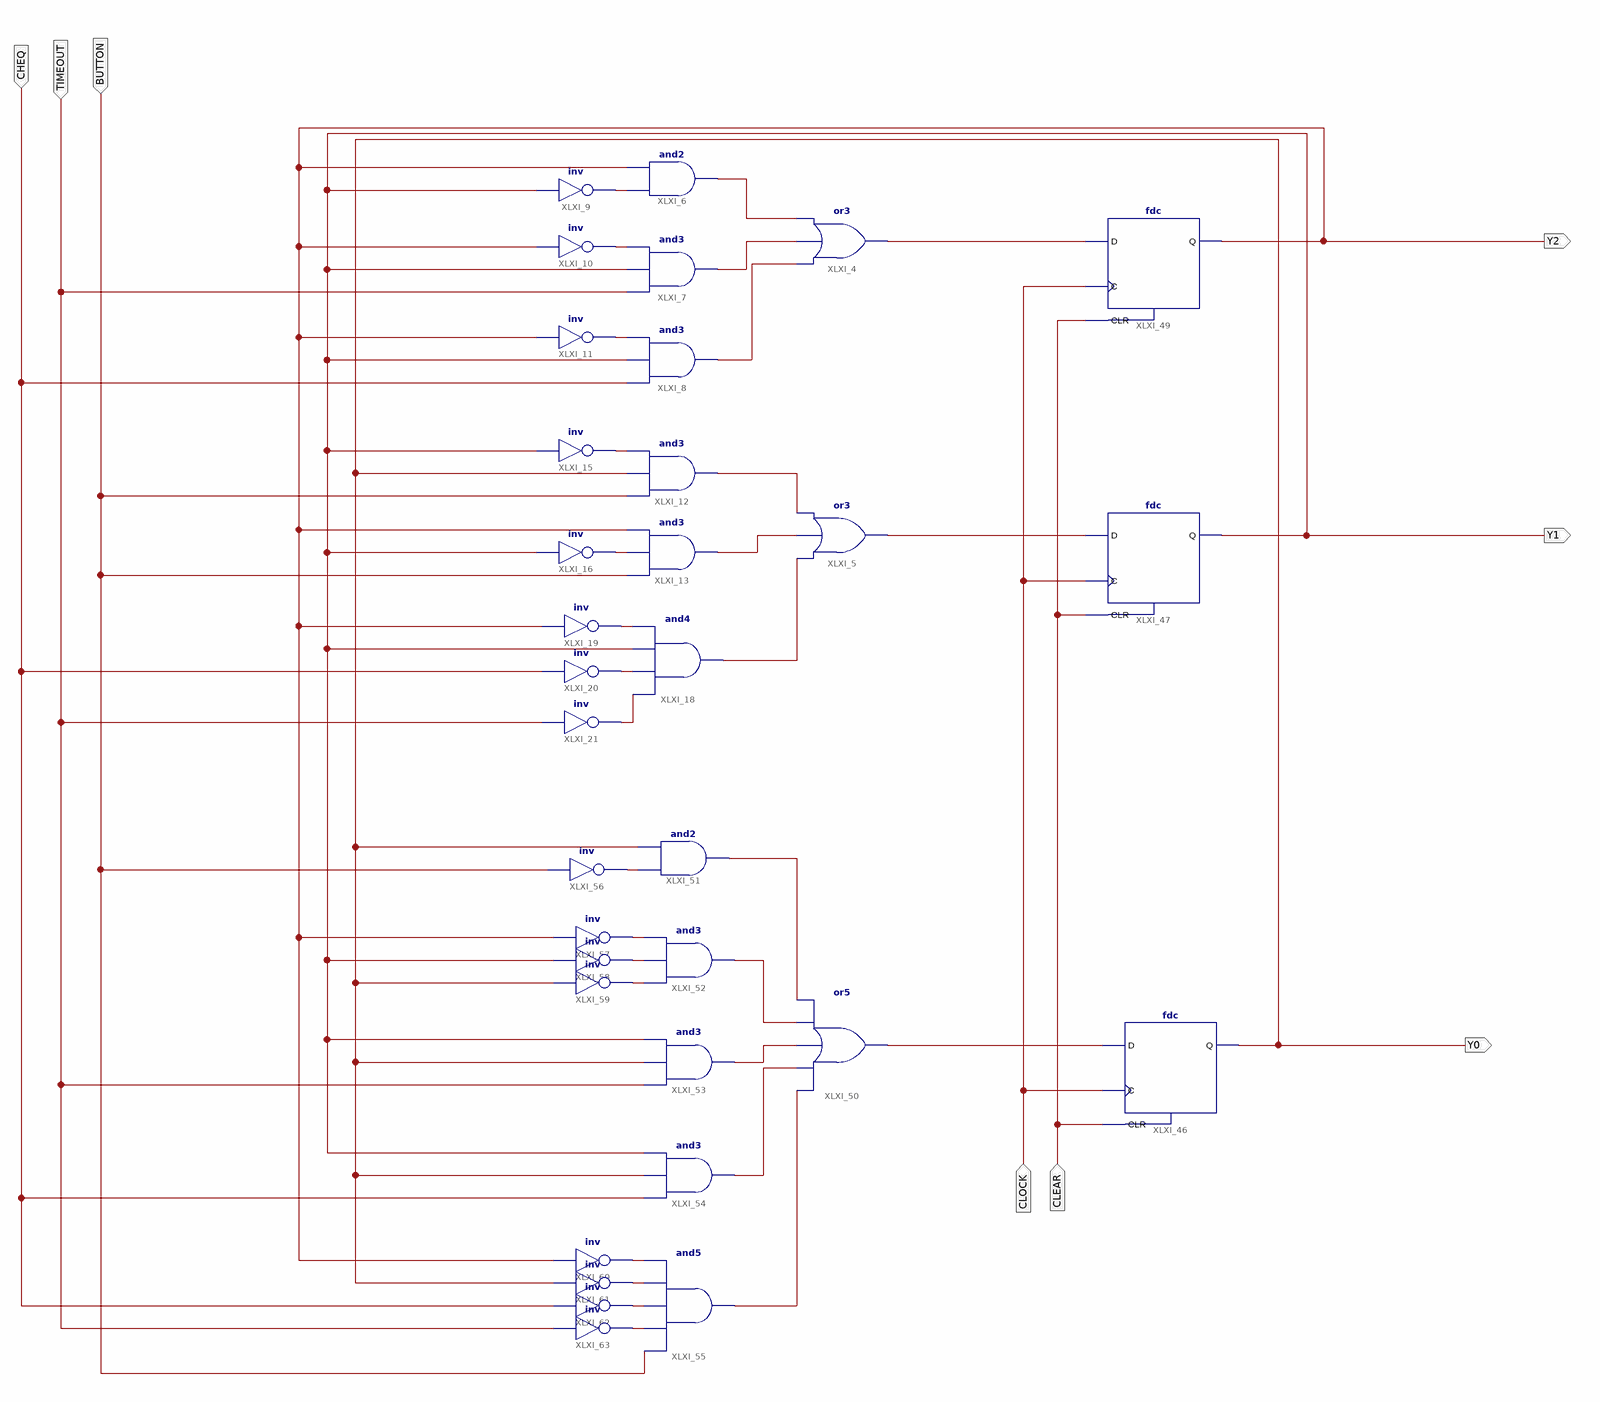
[diagram p0: schematic sheet 1]
// Xilinx ISE schematic FSM.sch (spartan3) as structural Verilog: 33 symbols, 8 ports
module FSM (
  input  CLOCK,
  input  CLEAR,
  input  CHEQ,
  input  TIMEOUT,
  input  BUTTON,
  output Y2,
  output Y1,
  output Y0
);

  wire XLXN_1, XLXN_2, XLXN_3, XLXN_4, XLXN_5, XLXN_6, XLXN_7, XLXN_8, XLXN_9, XLXN_10, XLXN_12, XLXN_13,
       XLXN_15, XLXN_16, XLXN_17, XLXN_18, XLXN_19, XLXN_46, XLXN_47, XLXN_48, XLXN_49, XLXN_50, XLXN_51,
       XLXN_52, XLXN_53, XLXN_54, XLXN_55, XLXN_56, XLXN_57, XLXN_58;

  or XLXI_4 (XLXN_1, XLXN_5, XLXN_4, XLXN_3);
  or XLXI_5 (XLXN_2, XLXN_15, XLXN_10, XLXN_9);
  and XLXI_6 (XLXN_3, XLXN_6, Y2);
  and XLXI_7 (XLXN_4, TIMEOUT, Y1, XLXN_7);
  and XLXI_8 (XLXN_5, CHEQ, Y1, XLXN_8);
  not XLXI_9 (XLXN_6, Y1);
  not XLXI_10 (XLXN_7, Y2);
  not XLXI_11 (XLXN_8, Y2);
  and XLXI_12 (XLXN_9, BUTTON, Y0, XLXN_12);
  and XLXI_13 (XLXN_10, BUTTON, XLXN_13, Y2);
  not XLXI_15 (XLXN_12, Y1);
  not XLXI_16 (XLXN_13, Y1);
  and XLXI_18 (XLXN_15, XLXN_18, XLXN_17, Y1, XLXN_16);
  not XLXI_19 (XLXN_16, Y2);
  not XLXI_20 (XLXN_17, CHEQ);
  not XLXI_21 (XLXN_18, TIMEOUT);
  fdc XLXI_46 (.C(CLOCK), .CLR(CLEAR), .D(XLXN_19), .Q(Y0));
  fdc XLXI_47 (.C(CLOCK), .CLR(CLEAR), .D(XLXN_2), .Q(Y1));
  fdc XLXI_49 (.C(CLOCK), .CLR(CLEAR), .D(XLXN_1), .Q(Y2));
  or XLXI_50 (XLXN_19, XLXN_50, XLXN_49, XLXN_48, XLXN_47, XLXN_46);
  and XLXI_51 (XLXN_46, XLXN_51, Y0);
  and XLXI_52 (XLXN_47, XLXN_54, XLXN_53, XLXN_52);
  and XLXI_53 (XLXN_48, TIMEOUT, Y0, Y1);
  and XLXI_54 (XLXN_49, CHEQ, Y0, Y1);
  and XLXI_55 (XLXN_50, BUTTON, XLXN_58, XLXN_57, XLXN_56, XLXN_55);
  not XLXI_56 (XLXN_51, BUTTON);
  not XLXI_57 (XLXN_52, Y2);
  not XLXI_58 (XLXN_53, Y1);
  not XLXI_59 (XLXN_54, Y0);
  not XLXI_60 (XLXN_55, Y2);
  not XLXI_61 (XLXN_56, Y0);
  not XLXI_62 (XLXN_57, CHEQ);
  not XLXI_63 (XLXN_58, TIMEOUT);
endmodule
